# Altium schematic sheet Protection.SchDoc
size A4
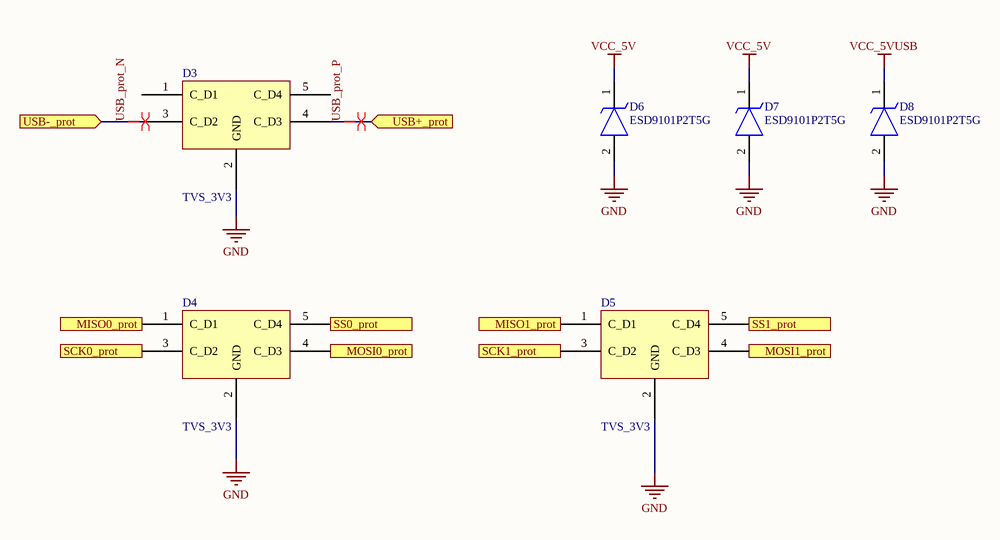
[diagram p0: Protection.SchDoc]

## Parts
D3  TVS_3V3  [SOT353]
D4  TVS_3V3  [SOT353]
D5  TVS_3V3  [SOT353]
D6  ESD9101P2T5G  [SODFL1006X40N]
D7  ESD9101P2T5G  [SODFL1006X40N]
D8  ESD9101P2T5G  [SODFL1006X40N]

## Ports
MISO0_prot (in), MISO1_prot (in), MOSI0_prot (in), MOSI1_prot (in), SCK0_prot (in), SCK1_prot (in), SS0_prot (in), SS1_prot (in), USB+_prot (in), USB-_prot (in)

## Nets
GND: D3.2(GND) D4.2(GND) D5.2(GND) D6.2(A) D7.2(A) D8.2(A)
VCC_5V: D6.1(K) D7.1(K)
VCC_5VUSB: D8.1(K)
MISO0_prot: D4.1(C_D1) ; port MISO0_prot
MISO1_prot: D5.1(C_D1) ; port MISO1_prot
MOSI0_prot: D4.4(C_D3) ; port MOSI0_prot
MOSI1_prot: D5.4(C_D3) ; port MOSI1_prot
SCK0_prot: D4.3(C_D2) ; port SCK0_prot
SCK1_prot: D5.3(C_D2) ; port SCK1_prot
SS0_prot: D4.5(C_D4) ; port SS0_prot
SS1_prot: D5.5(C_D4) ; port SS1_prot
USB_prot_N: D3.3(C_D2) ; port USB-_prot
USB_prot_P: D3.4(C_D3) ; port USB+_prot

Not connected (* = marked no-connect by the designer): D3 1(C_D1) 5(C_D4)

## Layout directives
differential pair: USB_prot_N, USB_prot_P

## Library data of the parts
D3-D5 = TVS_3V3: 4 TVS dedicated for 3.3V circuits; Manufacturer: Nexperia; Manufacturer Nr: PESD3V3L4UG,115
D6-D8 = ESD9101P2T5G: TVS Diode (Uni-directional); Manufacturer_Name: ON Semiconductor; Datasheet Link: http://www.onsemi.com/pub/Collateral/ESD9101-D.PDF; Height: 0.4mm; Manufacturer_Part_Number: ESD9101P2T5G; Mouser Part Number: 863-ESD9101P2T5G; Mouser Price/Stock: https://www.mouser.com/Search/Refine.aspx?Keyword=863-ESD9101P2T5G